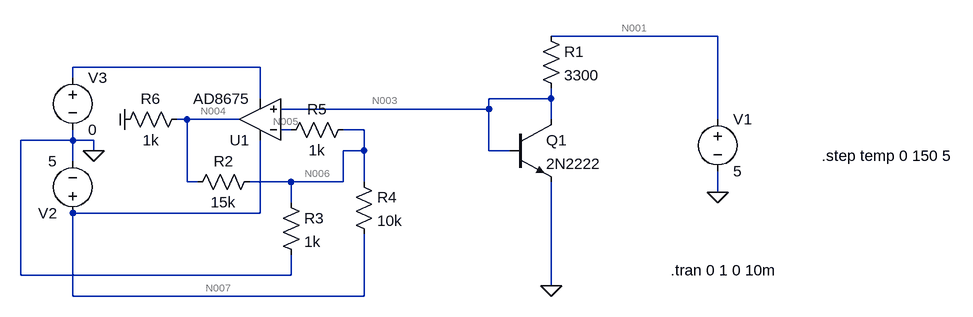
[diagram p0: schematic 2n2222-as-temp.asc]
2n2222-as-temp.asc, the LTspice schematic file:
Version 4
SHEET 1 1044 680
WIRE 640 16 384 16
WIRE -64 64 -352 64
WIRE -352 80 -352 64
WIRE -64 112 -64 64
WIRE 384 112 384 96
WIRE 384 112 288 112
WIRE 288 128 288 112
WIRE 288 128 -32 128
WIRE -176 144 -192 144
WIRE -96 144 -176 144
WIRE 384 144 384 112
WIRE 640 144 640 16
WIRE -16 160 -32 160
WIRE 96 160 64 160
WIRE -352 176 -352 160
WIRE -352 176 -432 176
WIRE -320 176 -352 176
WIRE -320 192 -320 176
WIRE 96 192 96 160
WIRE 96 192 64 192
WIRE 288 192 288 128
WIRE 320 192 288 192
WIRE -352 208 -352 176
WIRE -176 240 -176 144
WIRE -160 240 -176 240
WIRE -16 240 -80 240
WIRE 64 240 64 192
WIRE 64 240 -16 240
WIRE 96 240 96 192
WIRE 640 256 640 224
WIRE -16 272 -16 240
WIRE -64 288 -64 176
WIRE -64 288 -352 288
WIRE -432 384 -432 176
WIRE -16 384 -16 352
WIRE -16 384 -432 384
WIRE 384 400 384 240
WIRE -352 416 -352 288
WIRE 96 416 96 320
WIRE 96 416 -352 416
FLAG 384 400 0
FLAG 640 256 0
FLAG -320 192 0
FLAG -272 144 COM
IOPIN -272 144 In
SYMBOL npn 320 144 R0
SYMATTR InstName Q1
SYMATTR Value 2N2222
SYMBOL voltage 640 128 R0
WINDOW 123 0 0 Left 0
WINDOW 39 0 0 Left 0
SYMATTR InstName V1
SYMATTR Value 5
SYMBOL res 368 0 R0
SYMATTR InstName R1
SYMATTR Value 3300
SYMBOL Opamps\\AD8675 -64 208 R180
SYMATTR InstName U1
SYMBOL voltage -352 304 R180
WINDOW 123 0 0 Left 0
WINDOW 39 0 0 Left 0
SYMATTR InstName V2
SYMATTR Value 5
SYMBOL voltage -352 64 R0
WINDOW 123 0 0 Left 0
WINDOW 39 0 0 Left 0
SYMATTR InstName V3
SYMATTR Value 0
SYMBOL res -64 224 R90
WINDOW 0 0 56 VBottom 2
WINDOW 3 32 56 VTop 2
SYMATTR InstName R2
SYMATTR Value 15k
SYMBOL res -32 256 R0
SYMATTR InstName R3
SYMATTR Value 1k
SYMBOL res 80 224 R0
SYMATTR InstName R4
SYMATTR Value 10k
SYMBOL res 80 144 R90
WINDOW 0 0 56 VBottom 2
WINDOW 3 32 56 VTop 2
SYMATTR InstName R5
SYMATTR Value 1k
SYMBOL res -176 128 R90
WINDOW 0 0 56 VBottom 2
WINDOW 3 32 56 VTop 2
SYMATTR InstName R6
SYMATTR Value 1k
TEXT 800 200 Left 2 !.step temp 0 150 5
TEXT 568 376 Left 2 !.tran 0 1 0 10m

The netlist it stands for:
* 2n2222-as-temp.asc
Q1 N003 N003 0 0 2N2222
V1 N001 0 5
R1 N001 N003 3300
XU1 N003 N005 N007 N002 N004 AD8675  ; pins In+ In- V+ V- OUT
V2 N007 0 5
V3 N002 0 0
R2 N006 N004 15k
R3 N006 0 1k
R4 N006 N007 10k
R5 N006 N005 1k
R6 N004 COM 1k
.model NPN NPN
.model PNP PNP
.lib standard.bjt
.step temp 0 150 5
.tran 0 1 0 10m
.backanno
.end

* Results of the author's LTspice run, read from the files saved beside the schematic
* Operating Point (first step), zero values left out:
*   V(n003) = 709.2 mV
*   V(n001) = 5 V
*   V(n007) = 5 V
*   V(n005) = 714 mV
*   V(n004) = 4.994 V
*   V(n006) = 714 mV
*   V(com) = 4.994 V
*   Ic(Q1) = 1.293 mA
*   Ib(Q1) = 7.478 µA
*   Ie(Q1) = -1.3 mA
*   I(R5) = -503.6 pA
*   I(R4) = -428.6 µA
*   I(R3) = 714 µA
*   I(R2) = -285.4 µA
*   I(R1) = 1.3 mA
*   I(V3) = 2.665 mA
*   I(V2) = -3.379 mA
*   I(V1) = -1.3 mA
*   Ix(u1:1) = -503.6 pA
*   Ix(u1:2) = -503.6 pA
*   Ix(u1:3) = -16.92 mA
*   Ix(u1:4) = -2.665 mA
*   Ix(u1:5) = -285.4 µA
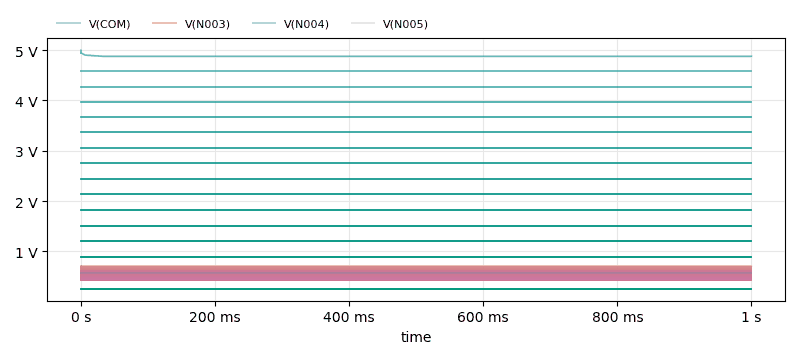
[diagram p1: Transient Analysis of 2n2222-as-temp.asc, plotted from the saved traces]
* Transient Analysis, 31 runs:
*   V(COM) [run 1]: min 4.876 V, max 4.994 V, average 4.877 V, rms 4.877 V, last 4.876 V
*   V(COM) [run 2]: min 4.577 V, max 4.577 V, average 4.577 V, rms 4.577 V, last 4.577 V
*   V(COM) [run 3]: min 4.277 V, max 4.277 V, average 4.277 V, rms 4.277 V, last 4.277 V
*   V(COM) [run 4]: min 3.975 V, max 3.975 V, average 3.975 V, rms 3.975 V, last 3.975 V
*   V(COM) [run 5]: min 3.672 V, max 3.672 V, average 3.672 V, rms 3.672 V, last 3.672 V
*   V(COM) [run 6]: min 3.367 V, max 3.367 V, average 3.367 V, rms 3.367 V, last 3.367 V
*   V(COM) [run 7]: min 3.061 V, max 3.061 V, average 3.061 V, rms 3.061 V, last 3.061 V
*   V(COM) [run 8]: min 2.754 V, max 2.754 V, average 2.754 V, rms 2.754 V, last 2.754 V
*   V(N003) [run 1]: min 709.2 mV, max 709.2 mV, average 709.2 mV, rms 709.2 mV, last 709.2 mV
*   V(N003) [run 2]: min 692 mV, max 692 mV, average 692 mV, rms 692 mV, last 692 mV
*   V(N003) [run 3]: min 674.7 mV, max 674.7 mV, average 674.7 mV, rms 674.7 mV, last 674.7 mV
*   V(N003) [run 4]: min 657.3 mV, max 657.3 mV, average 657.3 mV, rms 657.3 mV, last 657.3 mV
*   V(N003) [run 5]: min 639.8 mV, max 639.8 mV, average 639.8 mV, rms 639.8 mV, last 639.8 mV
*   V(N003) [run 6]: min 622.3 mV, max 622.3 mV, average 622.3 mV, rms 622.3 mV, last 622.3 mV
*   V(N003) [run 7]: min 604.7 mV, max 604.7 mV, average 604.7 mV, rms 604.7 mV, last 604.7 mV
*   V(N003) [run 8]: min 587 mV, max 587 mV, average 587 mV, rms 587 mV, last 587 mV
*   V(N004) [run 1]: min 4.876 V, max 4.994 V, average 4.877 V, rms 4.877 V, last 4.876 V
*   V(N004) [run 2]: min 4.577 V, max 4.577 V, average 4.577 V, rms 4.577 V, last 4.577 V
*   V(N004) [run 3]: min 4.277 V, max 4.277 V, average 4.277 V, rms 4.277 V, last 4.277 V
*   V(N004) [run 4]: min 3.975 V, max 3.975 V, average 3.975 V, rms 3.975 V, last 3.975 V
*   V(N004) [run 5]: min 3.672 V, max 3.672 V, average 3.672 V, rms 3.672 V, last 3.672 V
*   V(N004) [run 6]: min 3.367 V, max 3.367 V, average 3.367 V, rms 3.367 V, last 3.367 V
*   V(N004) [run 7]: min 3.061 V, max 3.061 V, average 3.061 V, rms 3.061 V, last 3.061 V
*   V(N004) [run 8]: min 2.754 V, max 2.754 V, average 2.754 V, rms 2.754 V, last 2.754 V
*   V(N005) [run 1]: min 707.2 mV, max 714 mV, average 707.2 mV, rms 707.2 mV, last 707.2 mV
*   V(N005) [run 2]: min 690.1 mV, max 690.1 mV, average 690.1 mV, rms 690.1 mV, last 690.1 mV
*   V(N005) [run 3]: min 673 mV, max 673 mV, average 673 mV, rms 673 mV, last 673 mV
*   V(N005) [run 4]: min 655.7 mV, max 655.7 mV, average 655.7 mV, rms 655.7 mV, last 655.7 mV
*   V(N005) [run 5]: min 638.4 mV, max 638.4 mV, average 638.4 mV, rms 638.4 mV, last 638.4 mV
*   V(N005) [run 6]: min 621 mV, max 621 mV, average 621 mV, rms 621 mV, last 621 mV
*   V(N005) [run 7]: min 603.5 mV, max 603.5 mV, average 603.5 mV, rms 603.5 mV, last 603.5 mV
*   V(N005) [run 8]: min 586 mV, max 586 mV, average 586 mV, rms 586 mV, last 586 mV